# Altium schematic sheet smartee_periph.SchDoc
size A
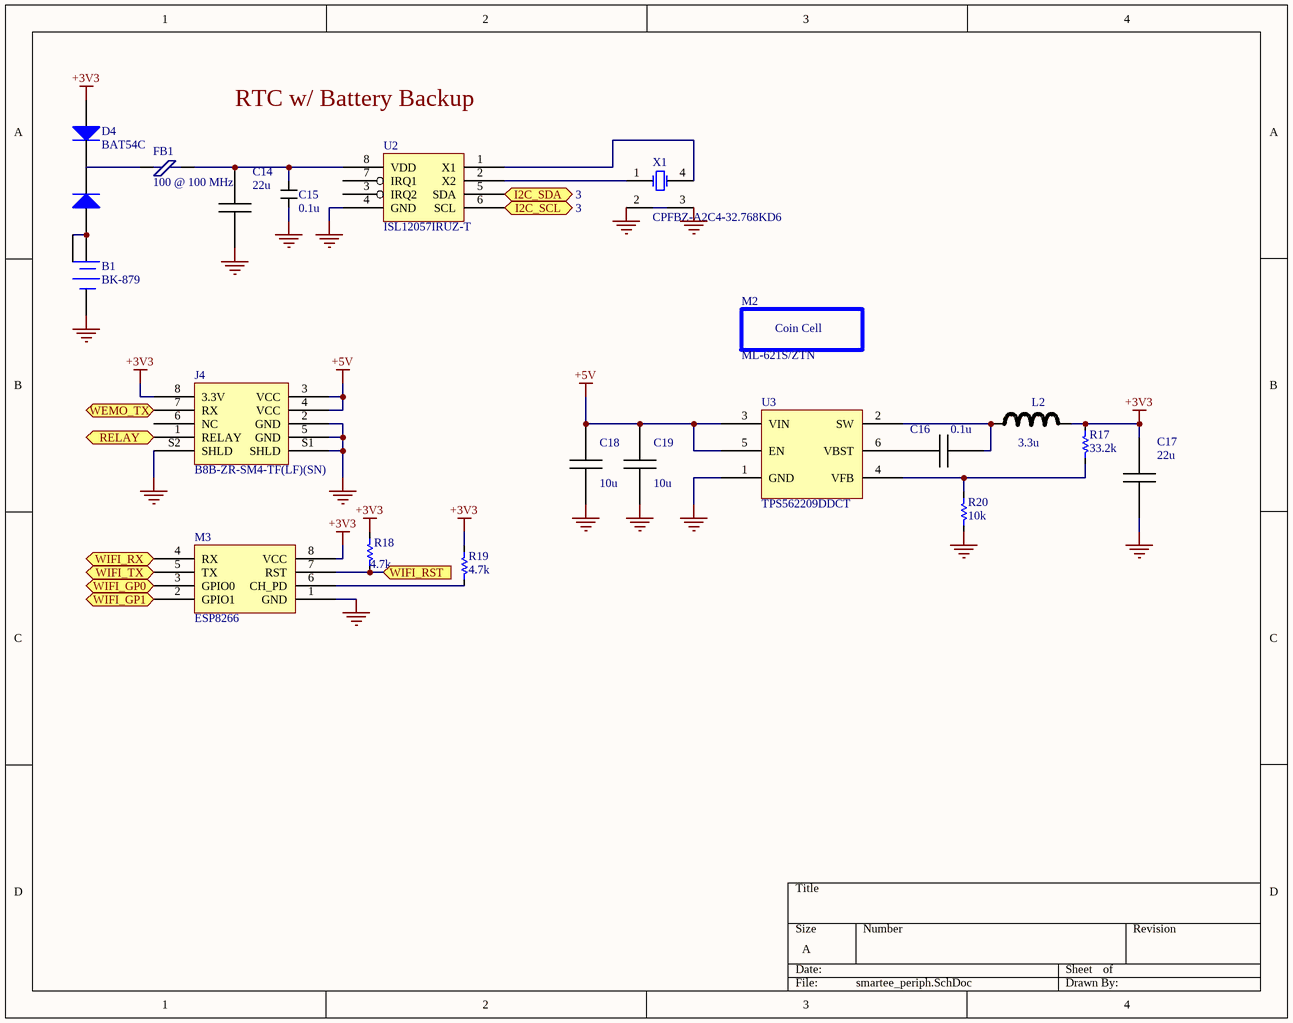
[diagram p0: smartee_periph.SchDoc]

## Parts
B1  BK-879  [BK-879]
C14  22u  [0805]
C15  0.1u  [R0603]
C16  0.1u  [0805]
C17  22u  [1206]
C18  10u  [0805]
C19  10u  [0805]
D4  BAT54C  [SOT23]
FB1  100 @ 100 MHz  [0603]
J4  B8B-ZR-SM4-TF(LF)(SN)  [B8B-ZR-SM4-TF]
L2  3.3u  [0805]
M2  ML-621S/ZTN  (mechanical)
M3  ESP8266  [ESP8266]
R17  value 33.2k  [0603]  (hidden comment: RES)
R18  value 4.7k  [0603]  (hidden comment: RES)
R19  value 4.7k  [0603]  (hidden comment: RES)
R20  value 10k  [0603]  (hidden comment: RES)
U2  ISL12057IRUZ-T  [UTDFN8]
U3  TPS562209DDCT  [TSOP-6]
X1  CPFBZ-A2C4-32.768KD6  [XTAL]

## Ports
I2C_SCL (in, see 3), I2C_SDA (bidir, see 3), RELAY (in), WEMO_TX (out), WIFI_GP0 (bidir), WIFI_GP1 (bidir), WIFI_RST (in), WIFI_RX (in), WIFI_TX (out)

## Nets
+3V3: C17.1 D4.2(A2) J4.8(3.3V) L2.2 M3.8(VCC) R17.1 R18.1 R19.1
+5V: C18.1 C19.1 J4.3(VCC) J4.4(VCC) U3.3(VIN) U3.5(EN)
GND: B1.N C14.2 C15.2 C17.2 C18.2 C19.2 J4.2(GND) J4.5(GND) J4.S1(SHLD) J4.S2(SHLD) M3.1(GND) R20.2 U2.4(GND) U3.1(GND) X1.2 X1.3
I2C_SCL: U2.6(SCL) ; port I2C_SCL
I2C_SDA: U2.5(SDA) ; port I2C_SDA
RELAY: J4.1(RELAY) ; port RELAY
WEMO_TX: J4.7(RX) ; port WEMO_TX
WIFI_GP0: M3.3(GPIO0) ; port WIFI_GP0
WIFI_GP1: M3.2(GPIO1) ; port WIFI_GP1
WIFI_RST: M3.7(RST) R18.2 ; port WIFI_RST
WIFI_RX: M3.4(RX) ; port WIFI_RX
WIFI_TX: M3.5(TX) ; port WIFI_TX
NetB1_P1: B1.P1 B1.P2 D4.1(A1)
NetC14_1: C14.1 C15.1 FB1.2 U2.8(VDD)
NetC16_1: C16.1 U3.6(VBST)
NetC16_2: C16.2 L2.1 U3.2(SW)
NetD4_3: D4.3(K) FB1.1
NetM3_6: M3.6(CH_PD) R19.2
NetR17_2: R17.2 R20.1 U3.4(VFB)
NetU2_1: U2.1(X1) X1.4
NetU2_2: U2.2(X2) X1.1(OSC1)

Not connected (* = marked no-connect by the designer): J4 6(NC); U2 3(IRQ2) 7(IRQ1)

## Notes on the sheet
- RTC w/ Battery Backup
- (in symbol ML-621S/ZTN) Coin Cell

## Library data of the parts
B1 = BK-879: HOLDER 6.8MM COIN CELL SMD; Manufacturer: MPD (Memory Protection Devices); Battery Type, Function: Coin Cell, Retainer; Style: Retainer; Battery Cell Size: Coin, 6.8mm; Number of Cells: 1; Battery Series: 364, 621; Supplier 1: Digi-Key; Manufacturer Part Number: BK-879; RoHS: RoHS Compliant; Category: Battery Products; Stock 1: 1702; Pricing 1: 1=0.32, 10=0.3, 100=0.27, 500=0.24, 1000=0.2 (USD); Mounting Type: PCB, Surface Mount; Termination Style: SMD (SMT) Tab; Height Above Board: 0.110" (2.80mm); Operating Temperature: -; ComponentLink1URL: http://www.memoryprotectiondevices.com/datasheets/BK-879-datasheet.pdf; ComponentLink1Description: http://www.memoryprotectiondevices.com/datasheets/BK-879-datasheet.pdf; Supplier Part Number 1: BK-879-ND
C14 = CL21A226MAQNNNE: CAP CER 22UF 25V 20% X5R 0805; Manufacturer: Samsung Electro-Mechanics America, Inc; Capacitance: 22µF; Supplier 1: Digi-Key; Manufacturer Part Number: CL21A226MAQNNNE; RoHS: RoHS Compliant; Category: Capacitors; Stock 1: 750834; Pricing 1: 1=0.47, 10=0.411, 25=0.2936, 50=0.2496, 100=0.2055, 250=0.1644, 500=0.14972, 1000=0.13503 (USD); Packaging: Cut Tape (CT); Voltage - Rated: 25V; Tolerance: ±20%; Temperature Coefficient: X5R; Mounting Type: Surface Mount, MLCC; Operating Temperature: -55°C ~ 85°C; Applications: General Purpose; Ratings: -; Package / Case: 0805 (2012 Metric); Size / Dimension: 0.079" L x 0.049" W (2.00mm x 1.25mm); Height - Seated (Max): -; Thickness (Max): 0.055" (1.40mm); Lead Spacing: -; Features: -; Lead Style: -; ComponentLink1URL: http://www.samsungsem.com/servlet/FileDownload?type=spec&file=CL21A226MAQNNNE.pdf; ComponentLink1Description: http://www.samsungsem.com/servlet/FileDownload?type=spec&file=CL21A226MAQNNNE.pdf; Supplier Part Number 1: 1276-2908-1-ND
C15 = CC0603ZRY5V9BB104: CAP CER 0.1UF 50V Y5V 0603; Manufacturer: Yageo; Capacitance: 0.1µF; Tolerance: -20%, +80%; Temperature Coefficient: Y5V (F); Supplier 1: Digi-Key; Manufacturer Part Number: CC0603ZRY5V9BB104; RoHS: RoHS Compliant; Category: Capacitors; Stock 1: 130366; Pricing 1: 1=0.1, 10=0.017, 25=0.012, 100=0.0078, 250=0.0064, 500=0.00546, 1000=0.00426 (USD); Packaging: Cut Tape (CT); Voltage - Rated: 50V; Mounting Type: Surface Mount, MLCC; Operating Temperature: -30°C ~ 85°C; Applications: General Purpose; Ratings: -; Package / Case: 0603 (1608 Metric); Size / Dimension: 0.063" L x 0.031" W (1.60mm x 0.80mm); Height - Seated (Max): -; Thickness (Max): 0.035" (0.90mm); Lead Spacing: -; Features: -; Lead Style: -; ComponentLink1URL: http://www.yageo.com/documents/recent/UPY-GPHC_Y5V_6.3V-to-50V_5_revised.pdf; ComponentLink1Description: http://www.yageo.com/documents/recent/UPY-GPHC_Y5V_6.3V-to-50V_5_revised.pdf; Supplier Part Number 1: 311-1343-1-ND; Value: 0.1u
C16 = 08053C104KAT2A: CAP CER 0.1UF 25V 10% X7R 0805; Manufacturer: AVX Corporation; Capacitance: 0.1µF; Supplier 1: Digi-Key; Manufacturer Part Number: 08053C104KAT2A; RoHS: RoHS Compliant; Category: Capacitors; Stock 1: 1175205; Pricing 1: 1=0.1, 10=0.066, 100=0.0303, 250=0.02476, 500=0.02118, 1000=0.0165 (USD); Packaging: Cut Tape (CT); Tolerance: ±10%; Voltage - Rated: 25V; Temperature Coefficient: X7R; Mounting Type: Surface Mount, MLCC; Operating Temperature: -55°C ~ 125°C; Applications: General Purpose; Ratings: -; Package / Case: 0805 (2012 Metric); Size / Dimension: 0.079" L x 0.049" W (2.01mm x 1.25mm); Height - Seated (Max): -; Thickness (Max): 0.037" (0.94mm); Lead Spacing: -; Features: -; Lead Style: -; ComponentLink1URL: http://www.avx.com/docs/Catalogs/cx7r.pdf; ComponentLink1Description: http://www.avx.com/docs/Catalogs/cx7r.pdf; Supplier Part Number 1: 478-3755-1-ND
C17 = C3216X5R0J226K/1.6: CAP CER 22UF 6.3V 10% X5R 1206; Manufacturer: TDK Corporation; Capacitance: 22µF; Supplier 1: Digi-Key; Manufacturer Part Number: C3216X5R0J226K/1.6; RoHS: RoHS Compliant; Category: Capacitors; Stock 1: 117320; Pricing 1: 1=0.48, 10=0.42, 100=0.21, 250=0.168, 500=0.153, 1000=0.138 (USD); Packaging: Cut Tape (CT); Tolerance: ±10%; Voltage - Rated: 6.3V; Temperature Coefficient: X5R; Mounting Type: Surface Mount, MLCC; Operating Temperature: -55°C ~ 85°C; Applications: General Purpose; Ratings: -; Package / Case: 1206 (3216 Metric); Size / Dimension: 0.126" L x 0.063" W (3.20mm x 1.60mm); Height - Seated (Max): -; Thickness (Max): 0.071" (1.80mm); Lead Spacing: -; Features: -; Lead Style: -; ComponentLink1URL: http://media.digikey.com/pdf/Data%20Sheets/TDK%20PDFs/C_Series_GeneralAppl_B11.pdf; ComponentLink1Description: http://media.digikey.com/pdf/Data%20Sheets/TDK%20PDFs/C_Series_GeneralAppl_B11.pdf; Supplier Part Number 1: 445-4059-1-ND
C18 C19 = C0805C106K8PACTU: CAP CER 10UF 10V 10% X5R 0805; Manufacturer: Kemet; Capacitance: 10µF; Supplier 1: Digi-Key; Manufacturer Part Number: C0805C106K8PACTU; RoHS: RoHS Compliant; Category: Capacitors; Stock 1: 172957; Pricing 1: 1=0.21, 10=0.14, 50=0.085, 100=0.0714, 250=0.0578, 500=0.051, 1000=0.04335 (USD); Packaging: Cut Tape (CT); Tolerance: ±10%; Voltage - Rated: 10V; Temperature Coefficient: X5R; Mounting Type: Surface Mount, MLCC; Operating Temperature: -55°C ~ 85°C; Applications: General Purpose; Ratings: -; Package / Case: 0805 (2012 Metric); Size / Dimension: 0.079" L x 0.049" W (2.00mm x 1.25mm); Height - Seated (Max): -; Thickness (Max): 0.055" (1.40mm); Lead Spacing: -; Features: -; Lead Style: -; ComponentLink1URL: http://www.kemet.com/docfinder?Partnumber=C0805C106K8PACTU; ComponentLink1Description: http://www.kemet.com/docfinder?Partnumber=C0805C106K8PACTU; Supplier Part Number 1: 399-4925-1-ND
D4 = BAT54C: DIODE SCHOTTKY 30V 200MA SOT23; Manufacturer: Fairchild Semiconductor; Diode Configuration: 1 Pair Common Cathode; Voltage - Forward (Vf) (Max) @ If: 800mV @ 100mA; Speed: Small Signal =< 200mA (Io), Any Speed; Reverse Recovery Time (trr): 5ns; Current - Reverse Leakage @ Vr: 2µA @ 25V; Supplier 1: Digi-Key; Manufacturer Part Number: BAT54C; RoHS: RoHS Compliant; Category: Discrete Semiconductor Products; Stock 1: 113590; Pricing 1: 1=0.2, 10=0.183, 25=0.166, 100=0.1196, 250=0.07044, 500=0.05844, 1000=0.03986 (USD); Packaging: Cut Tape (CT); Diode Type: Schottky; Voltage - DC Reverse (Vr) (Max): 30V; Current - Average Rectified (Io) (per Diode): 200mA; Mounting Type: Surface Mount; Package / Case: TO-236-3, SC-59, SOT-23-3; Supplier Device Package: SOT-23-3 (TO-236); ComponentLink1URL: http://www.fairchildsemi.com/ds/BA/BAT54.pdf; ComponentLink1Description: http://www.fairchildsemi.com/ds/BA/BAT54.pdf; Supplier Part Number 1: BAT54CFSCT-ND
FB1 = MPZ1608S101ATAH0: FERRITE CHIP 100 OHM 3A 0603; Manufacturer: TDK Corporation; Impedance @ Frequency: 100 Ohm @ 100MHz; DC Resistance (DCR): 30 mOhm Max; Filter Type: Differential Mode - Single; Supplier 1: Digi-Key; Manufacturer Part Number: MPZ1608S101ATAH0; RoHS: RoHS Compliant; Category: Filters; Stock 1: 219330; Pricing 1: 1=0.1, 10=0.079, 100=0.0472, 250=0.03432, 500=0.03146, 1000=0.02717 (USD); Packaging: Cut Tape (CT); Current Rating: 3A; Package / Case: 0603 (1608 Metric); Mounting Type: Surface Mount; Height (Max): 0.030" (0.75mm); Size / Dimension: 0.063" L x 0.031" W (1.60mm x 0.80mm); ComponentLink1URL: http://product.tdk.com/en/catalog/datasheets/beads_commercial_power_mpz_en.pdf; ComponentLink1Description: http://product.tdk.com/en/catalog/datasheets/beads_commercial_power_mpz_en.pdf; Supplier Part Number 1: 445-1564-1-ND
J4 = B8B-ZR-SM4-TF(LF)(SN): CONN HEADER ZH TOP 8POS 1.5MM; Manufacturer: JST Sales America Inc; Connector Type: Header, Shrouded; Number of Positions: 8; Number of Positions Loaded: All; Pitch: 0.059" (1.50mm); Supplier 1: Digi-Key; Manufacturer Part Number: B8B-ZR-SM4-TF(LF)(SN); RoHS: RoHS Compliant; Category: Connectors, Interconnects; Stock 1: 9275; Pricing 1: 1=0.84, 10=0.74, 25=0.6968, 50=0.6678, 100=0.6388, 250=0.58068, 500=0.52262 (USD); Packaging: Cut Tape (CT); Contact Type: Male Pin; Number of Rows: 1; Row Spacing: -; Contact Mating Length: -; Mounting Type: Surface Mount; Termination: Solder; Fastening Type: Detent Lock; Features: Solder Retention; Contact Finish: Tin; Contact Finish Thickness: -; Color: Natural; ComponentLink1URL: http://www.jst-mfg.com/product/pdf/eng/eZH.pdf; ComponentLink1Description: http://www.jst-mfg.com/product/pdf/eng/eZH.pdf; Supplier Part Number 1: 455-1687-1-ND
L2 = MLP2012S3R3MT0S1: FIXED IND 3.3UH 900MA 190 MOHM; Manufacturer: TDK Corporation; Type: Multilayer; Material - Core: Ferrite; Inductance: 3.3µH; Tolerance: ±20%; Shielding: Shielded; Frequency - Test: 2MHz; Supplier 1: Digi-Key; Manufacturer Part Number: MLP2012S3R3MT0S1; RoHS: RoHS Compliant; Category: Inductors, Coils, Chokes; Stock 1: 8776; Pricing 1: 1=0.36, 10=0.328, 50=0.2548, 100=0.2366, 500=0.20748, 1000=0.16744 (USD); Packaging: Cut Tape (CT); Current Rating: 900mA; Current - Saturation: -; DC Resistance (DCR): 190 mOhm; Q @ Freq: -; Frequency - Self Resonant: -; Operating Temperature: -40°C ~ 125°C; Mounting Type: Surface Mount; Package / Case: 0805 (2012 Metric); Size / Dimension: 0.079" L x 0.049" W (2.00mm x 1.25mm); Height - Seated (Max): 0.039" (1.00mm); Supplier Device Package: 0805 (2012 Metric); ComponentLink1URL: http://product.tdk.com/en/catalog/datasheets/inductor_commercial_power_mlp_en.pdf; ComponentLink1Description: http://product.tdk.com/en/catalog/datasheets/inductor_commercial_power_mlp_en.pdf; Supplier Part Number 1: 445-6365-1-ND
M2 = ML-621S/ZTN: BATTERY LITHIUM 3V RECHARGE; Manufacturer: Panasonic - BSG; Battery Cell Size: Coin, 6.8mm; Capacity: 5mAh; Discharge Rate: 10µA; Standard Charge Current: 600µA; Shipping Info: Due to possible restrictions, a change in ship method may be required.; Supplier 1: Digi-Key; Manufacturer Part Number: ML-621S/ZTN; RoHS: RoHS Compliant By Exemption; Category: Battery Products; Stock 1: 45217; Pricing 1: 1=1.78, 10=1.598, 50=1.42, 100=1.2425, 250=1.136, 500=1.065, 2000=0.97625, 4000=0.9443 (USD); Battery Chemistry: Lithium; Voltage - Rated: 3V; Size / Dimension: 0.27" Dia x 0.09" H (6.8mm x 2.2mm); Termination Style: Requires Holder; Standard Charge Time: -; Weight: 0.01 oz (0.28g); ComponentLink1URL: http://na.industrial.panasonic.com/sites/default/pidsa/files/mlseries_datasheets_merged.pdf; ComponentLink1Description: http://na.industrial.panasonic.com/sites/default/pidsa/files/mlseries_datasheets_merged.pdf; Supplier Part Number 1: P007-ND
M3 = ESP8266: WiFi UART module
R17-R20 = RES: Resistor; Published: 8-Jun-2000; LatestRevisionDate: 17-Jul-2002; LatestRevisionNote: Re-released for DXP Platform.; Publisher: Altium Limited
U2 = ISL12057IRUZ-T: IC RTC CLK/CALENDAR I2C 8-UTDFN; Manufacturer: Intersil; Time Format: HH:MM:SS (12/24 hr); Date Format: YY-MM-DD-dd; Interface: I²C, 2-Wire Serial; Voltage - Supply: 1.8 V ~ 3.6 V; Current - Timekeeping (Max): 0.65µA @ 1.8V; Supplier 1: Digi-Key; Manufacturer Part Number: ISL12057IRUZ-T; RoHS: RoHS Compliant; Category: Integrated Circuits (ICs); Stock 1: 2898; Pricing 1: 1=2.65, 25=1.98, 100=1.68 (USD); Packaging: Cut Tape (CT); Type: Clock/Calendar; Features: Alarm, Leap Year; Memory Size: -; Voltage - Supply, Battery: -; Operating Temperature: -40°C ~ 85°C; Mounting Type: Surface Mount; Package / Case: 8-UFDFN; Supplier Device Package: *; ComponentLink1URL: http://www.intersil.com/content/dam/Intersil/documents/fn67/fn6755.pdf; ComponentLink1Description: http://www.intersil.com/content/dam/Intersil/documents/fn67/fn6755.pdf; Supplier Part Number 1: ISL12057IRUZ-TCT-ND
U3 = TPS562209DDCT: IC REG BUCK SYNC ADJ 2A SOT-23-6; Manufacturer: Texas Instruments; Output Type: Adjustable; Number of Outputs: 1; Voltage - Output: 0.76 V ~ 7 V; Voltage - Input: 4.5 V ~ 17 V; Frequency - Switching: 650kHz; Synchronous Rectifier: Yes; Supplier 1: Digi-Key; Manufacturer Part Number: TPS562209DDCT; RoHS: RoHS Compliant; Category: Integrated Circuits (ICs); Stock 1: 208; Pricing 1: 1=1.76, 10=1.554, 25=1.4024, 100=1.2272 (USD); Packaging: Cut Tape (CT); Type: Step-Down (Buck); Current - Output: 2A; Operating Temperature: -40°C ~ 85°C; Mounting Type: Surface Mount; Package / Case: SOT-23-6 Thin, TSOT-23-6; Supplier Device Package: SOT-6; ComponentLink1URL: http://www.ti.com/lit/ds/symlink/tps562209.pdf; ComponentLink1Description: http://www.ti.com/lit/ds/symlink/tps562209.pdf; Supplier Part Number 1: 296-37302-1-ND
X1 = CPFBZ-A2C4-32.768KD6: CRYSTAL 32.768KHZ 6PF SMD; Manufacturer: Cardinal Components Inc.; Frequency Tolerance: ±10ppm; ESR (Equivalent Series Resistance): 50 kOhm; Operating Mode: Fundamental; Supplier 1: Digi-Key; Manufacturer Part Number: CPFBZ-A2C4-32.768KD6; RoHS: RoHS Compliant; Category: Crystals and Oscillators; Stock 1: 6155; Pricing 1: 1=0.61, 10=0.511, 50=0.4588, 100=0.4082, 500=0.3888, 1000=0.32659 (USD); Packaging: Cut Tape (CT); Type: kHz Crystal (Tuning Fork); Frequency: 32.768kHz; Frequency Stability: -; Load Capacitance: 6pF; Operating Temperature: -40°C ~ 85°C; Ratings: -; Mounting Type: Surface Mount; Package / Case: 4-SMD; Size / Dimension: 0.343" L x 0.146" W (8.70mm x 3.70mm); Height: 0.098" (2.50mm); ComponentLink1URL: http://www.cardinalxtal.com/uploads/files/cpfb.pdf; ComponentLink1Description: http://www.cardinalxtal.com/uploads/files/cpfb.pdf; Supplier Part Number 1: 370-1057-1-ND